# EAGLE schematic pl5_redraw (EAGLE 8.5.1)
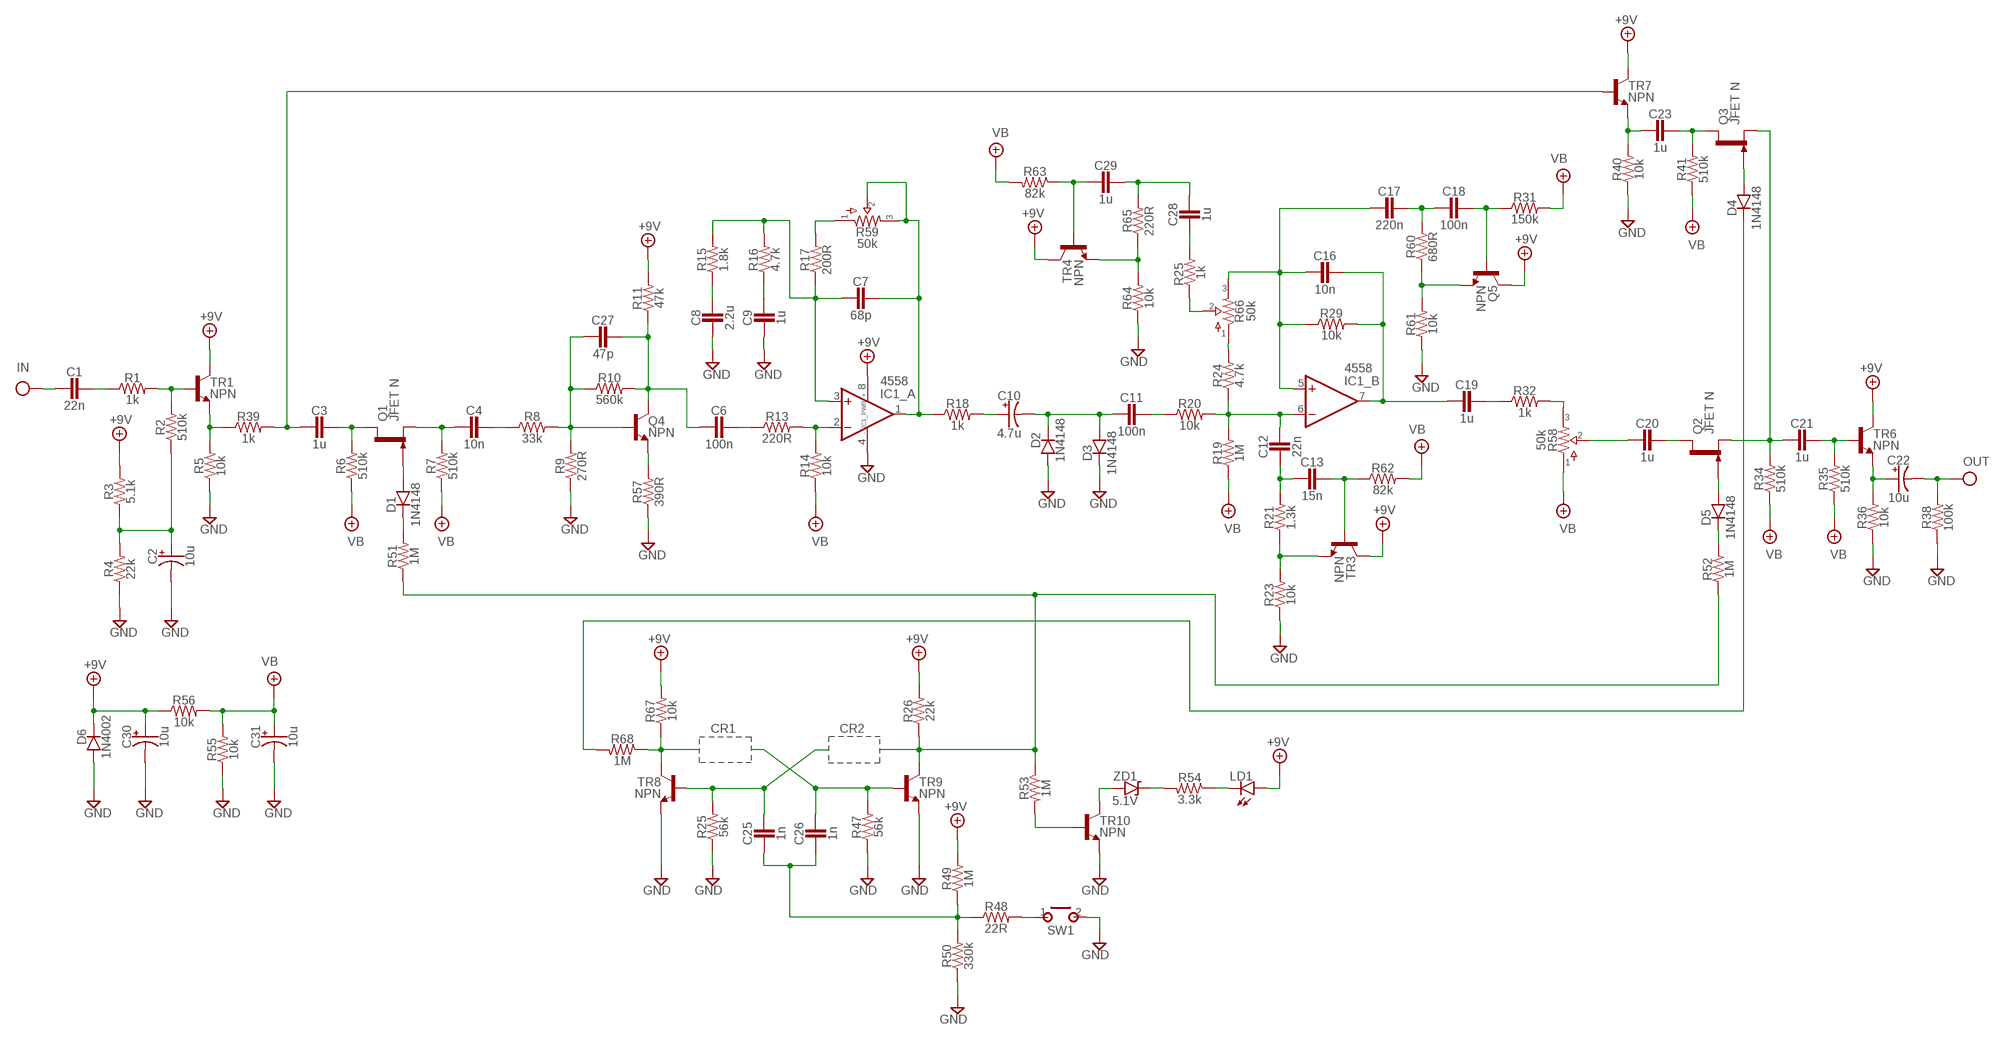
[diagram p0: schematic, sheet 1]

## Parts
C1  22n  CER/FILMBOX.1  [BOX_SMALL]
C2  10u  0500  [050_020]
C3  1u  CER/FILMBOX.1  [BOX_SMALL]
C4  10n  CER/FILMBOX.1  [BOX_SMALL]
C6  100n  CER/FILMBOX.1  [BOX_SMALL]
C7  68p  CER/FILMBOX.1  [BOX_SMALL]
C8  2.2u  CER/FILMBOX.1  [BOX_SMALL]
C9  1u  CER/FILMBOX.1  [BOX_SMALL]
C10  4.7u  0500  [050_020]
C11  100n  CER/FILMBOX.1  [BOX_SMALL]
C12  22n  CER/FILMBOX.1  [BOX_SMALL]
C13  15n  CER/FILMBOX.1  [BOX_SMALL]
C16  10n  CER/FILMBOX.1  [BOX_SMALL]
C17  220n  CER/FILMBOX.1  [BOX_SMALL]
C18  100n  CER/FILMBOX.1  [BOX_SMALL]
C19  1u  CER/FILMBOX.1  [BOX_SMALL]
C20  1u  CER/FILMBOX.1  [BOX_SMALL]
C21  1u  CER/FILMBOX.1  [BOX_SMALL]
C22  10u  0500  [050_020]
C23  1u  CER/FILMBOX.1  [BOX_SMALL]
C25  1n  CER/FILMBOX.1  [BOX_SMALL]
C26  1n  CER/FILMBOX.1  [BOX_SMALL]
C27  47p  CER/FILMBOX.1  [BOX_SMALL]
C28  1u  CER/FILMBOX.1  [BOX_SMALL]
C29  1u  CER/FILMBOX.1  [BOX_SMALL]
C30  10u  0500  [050_020]
C31  10u  0500  [050_020]
D1  1N4148  DO35.2  [DO35-2]
D2  1N4148  DO35.2  [DO35-2]
D3  1N4148  DO35.2  [DO35-2]
D4  1N4148  DO35.2  [DO35-2]
D5  1N4148  DO35.2  [DO35-2]
D6  1N4002  DO35.2  [DO35-2]
IC1  4558  DUALTH  [DIL0]
LD1  LED  [3MM_D]
Q1  JFET N  2N3819TO-92S  [TO92-]
Q2  JFET N  2N3819TO-92S  [TO92-]
Q3  JFET N  2N3819TO-92S  [TO92-]
Q4  NPN  2SC828A  [TO92-]
Q5  NPN  2SC828A  [TO92-]
R1  1k  R_.3B  [R0207/3]
R2  510k  R_.3B  [R0207/3]
R3  5.1k  R_.3B  [R0207/3]
R4  22k  R_.3B  [R0207/3]
R5  10k  R_.3B  [R0207/3]
R6  510k  R_.3B  [R0207/3]
R7  510k  R_.3B  [R0207/3]
R8  33k  R_.3B  [R0207/3]
R9  270R  R_.3B  [R0207/3]
R10  560k  R_.3B  [R0207/3]
R11  47k  R_.3B  [R0207/3]
R13  220R  R_.3B  [R0207/3]
R14  10k  R_.3B  [R0207/3]
R15  1.8k  R_.3B  [R0207/3]
R16  4.7k  R_.3B  [R0207/3]
R17  200R  R_.3B  [R0207/3]
R18  1k  R_.3B  [R0207/3]
R19  1M  R_.3B  [R0207/3]
R20  10k  R_.3B  [R0207/3]
R21  1.3k  R_.3B  [R0207/3]
R23  10k  R_.3B  [R0207/3]
R24  4.7k  R_.3B  [R0207/3]
R25  56k  R_.3B  [R0207/3]
R25   1k  R_.3B  [R0207/3]
R26  22k  R_.3B  [R0207/3]
R29  10k  R_.3B  [R0207/3]
R31  150k  R_.3B  [R0207/3]
R32  1k  R_.3B  [R0207/3]
R34  510k  R_.3B  [R0207/3]
R35  510k  R_.3B  [R0207/3]
R36  10k  R_.3B  [R0207/3]
R38  100k  R_.3B  [R0207/3]
R39  1k  R_.3B  [R0207/3]
R40  10k  R_.3B  [R0207/3]
R41  510k  R_.3B  [R0207/3]
R47  56k  R_.3B  [R0207/3]
R48  22R  R_.3B  [R0207/3]
R49  1M  R_.3B  [R0207/3]
R50  330k  R_.3B  [R0207/3]
R51  1M  R_.3B  [R0207/3]
R52  1M  R_.3B  [R0207/3]
R53  1M  R_.3B  [R0207/3]
R54  3.3k  R_.3B  [R0207/3]
R55  10k  R_.3B  [R0207/3]
R56  10k  R_.3B  [R0207/3]
R57  390R  R_.3B  [R0207/3]
R58  50k  POTS16MM  [16MM]
R59  50k  POTS16MM  [16MM]
R60  680R  R_.3B  [R0207/3]
R61  10k  R_.3B  [R0207/3]
R62  82k  R_.3B  [R0207/3]
R63  82k  R_.3B  [R0207/3]
R64  10k  R_.3B  [R0207/3]
R65  220R  R_.3B  [R0207/3]
R66  50k  POTS16MM  [16MM]
R67  10k  R_.3B  [R0207/3]
R68  1M  R_.3B  [R0207/3]
SW1  MOMENTARY  [SPST]
TR1  NPN  2SC828A  [TO92-]
TR3  NPN  2SC828A  [TO92-]
TR4  NPN  2SC828A  [TO92-]
TR6  NPN  2SC828A  [TO92-]
TR7  NPN  2SC828A  [TO92-]
TR8  NPN  2SC828A  [TO92-]
TR9  NPN  2SC828A  [TO92-]
TR10  NPN  2SC828A  [TO92-]
ZD1  5.1V  ZENER.2  [DO41-2]

## Nets
+9V: C30.+ D6.C IC1.8(_PWR:V+) LD1.ANODE(A) Q5.2(C) R3.2 R11.2 R26.2 R49.2 R56.1 R67.2 TR1.2(C) TR3.2(C) TR4.2(C) TR6.2(C) TR7.2(C)
GND: C2.- C8.2 C9.2 C30.- C31.- D2.A D3.C D6.A IC1.4(_PWR:V-) R4.1 R5.1 R9.1 R23.1 R25.1 R36.1 R38.1 R40.1 R47.1 R50.1 R55.1 R57.1 R61.1 R64.1 SW1.2(S) TR8.3(E) TR9.3(E) TR10.3(E)
IN: C1.2
N$1: LD1.P$1(C) R54.1
N$2: R54.2 ZD1.C
N$3: TR10.2(C) ZD1.A
N$4: R53.2 TR10.1(B)
N$6: C3.2 R39.2 TR7.1(B)
N$7: C1.1 R1.1
N$8: R1.2 R2.2 TR1.1(B)
N$10: C3.1 Q1.3(D) R6.2
N$11: C2.+ R2.1 R3.1 R4.2
N$12: D1.A Q1.2(G)
N$13: D1.C R51.2
N$14: C4.2 Q1.1(S) R7.2
N$15: C4.1 R8.1
N$16: C27.2 Q4.1(B) R8.2 R9.2 R10.1
N$17: Q4.3(E) R57.2
N$18: C6.1 R13.1
N$19: C6.2 C27.1 Q4.2(C) R10.2 R11.1
N$20: IC1.2(_A:-IN) R13.2 R14.2
N$21: C7.2 IC1.3(_A:+IN) R15.2 R16.2 R17.1
N$22: R17.2 R59.1
N$23: C7.1 IC1.1(_A:OUT) R18.1 R59.2 R59.3
N$24: C8.1 R15.1
N$25: C9.1 R16.1
N$26: C25.2 C26.2 R48.1 R49.1 R50.2
N$27: C10.+ R18.2
N$28: C10.- C11.2 D2.C D3.A
N$29: R26.1 R51.1 R52.1 R53.1 TR9.2(C)
N$30: C11.1 R20.1
N$31: R67.1 R68.1 TR8.2(C)
N$32: C26.1 R47.2 TR9.1(B)
N$33: C12.1 IC1.6(_B:-IN) R19.2 R20.2 R24.1
N$34: C25.1 R25.2 TR8.1(B)
N$35: R48.2 SW1.1(P)
N$37: C12.2 C13.2 R21.2
N$38: C13.1 R62.1 TR3.1(B)
N$39: R21.1 R23.2 TR3.3(E)
N$40: C28.1 R25 .2
N$41: R25 .1 R66.2
N$42: C28.2 C29.2 R65.2
N$43: C29.1 R63.1 TR4.1(B)
N$44: R64.2 R65.1 TR4.3(E)
N$45: R24.2 R66.1
N$46: C16.2 C17.2 IC1.5(_B:+IN) R29.1 R66.3
N$47: C17.1 C18.2 R60.2
N$48: C16.1 C19.2 IC1.7(_B:OUT) R29.2
N$49: C18.1 Q5.1(B) R31.1
N$50: Q5.3(E) R60.1 R61.2
N$51: C19.1 R32.1
N$52: R32.2 R58.3
N$53: C20.2 R58.2
N$54: C23.2 R40.2 TR7.3(E)
N$55: C23.1 Q3.3(D) R41.2
N$56: D4.A Q3.2(G)
N$57: C20.1 Q2.3(D)
N$58: D5.A Q2.2(G)
N$59: D5.C R52.2
N$60: C21.2 Q2.1(S) Q3.1(S) R34.2
N$61: C21.1 R35.2 TR6.1(B)
N$62: C22.+ R36.2 TR6.3(E)
N$64: D4.C R68.2
N$66: R5.2 R39.1 TR1.3(E)
OUT: C22.- R38.2
VB: C31.+ R6.1 R7.1 R14.1 R19.1 R31.2 R34.1 R35.1 R41.1 R55.2 R56.2 R58.1 R62.2
VB1: R63.2 ; supply symbol labelled VB

## Notes on the sheet
- CR1 | CR2

## Library data of the parts
C1 C3 C4 C6-C9 C11-C13 C16-C21 C23 C25-C29 = pedals-capacitors-film:CER/FILM: 47 - 120pF Xicon Ceramic Disc 2.5mm lead spacing
C2 C10 C22 C30 C31 = pedals-capacitors-elec:050
D1-D6 = pedals-diodes:DO35: DO-35 Package Diodes: 1N914
IC1 = pedals-integrated circuits:DUAL: OP AMP
LD1 = pedals-diodes:LED
Q1-Q3 = pedals-transistors:2N3819: N-CHANNEL FET
Q4 Q5 TR1 TR3 TR4 TR6-TR10 = pedals-transistors:2SC828A
R1-R11 R13-R21 R23-R25 R25  R26 R29 R31 R32 R34-R36 R38-R41 R47-R57 R60-R65 R67 R68 = pedals-resistors:R_
R58 R59 R66 = pedals-potentiometers:POTS
SW1 = pedals-switches:MOMENTARY
ZD1 = pedals-diodes:ZENER